# Altium schematic sheet imx8mnano_B.SchDoc
size A3; SheetNumber: 7; SheetTotal: 7
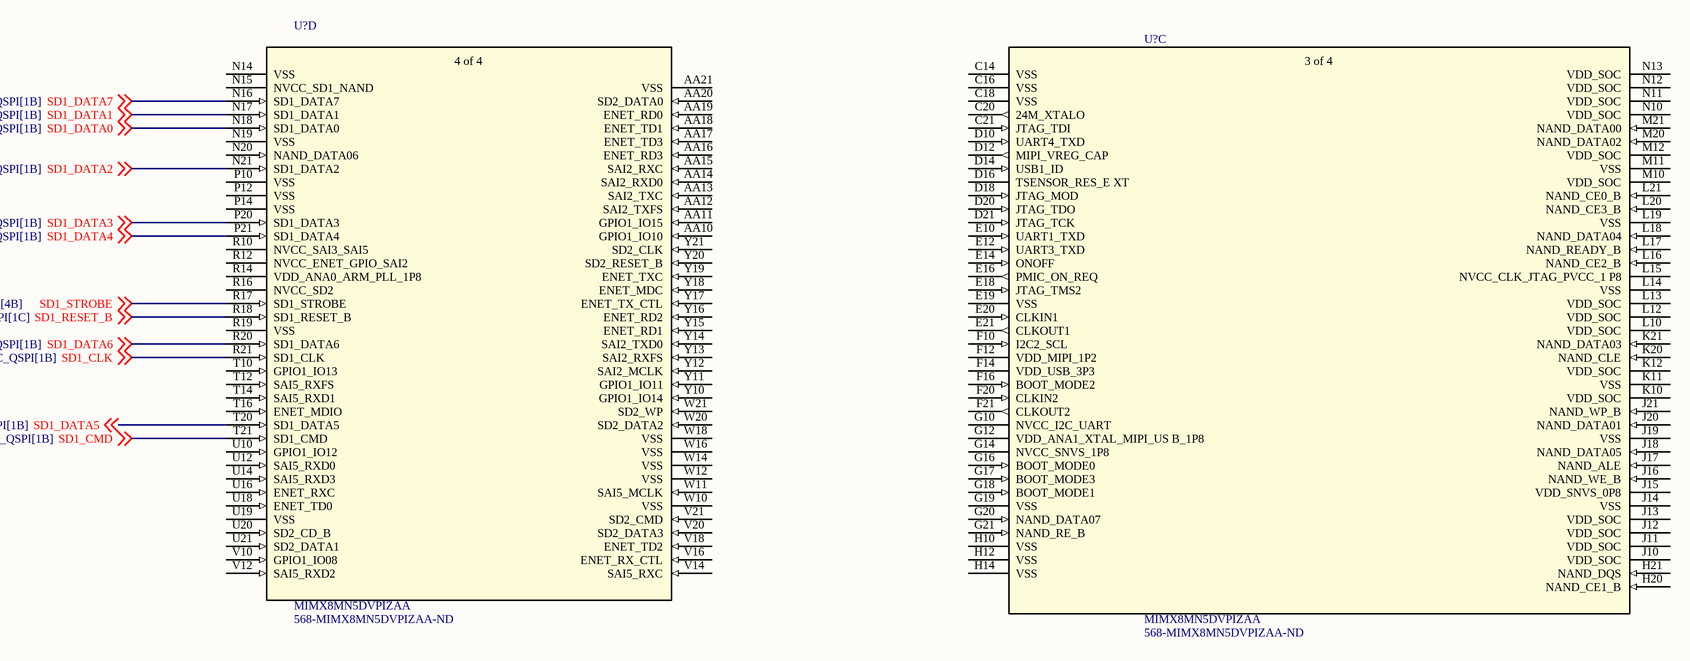
[diagram p0: imx8mnano_B.SchDoc]

## Parts
(Parts that share a designator on the sheet are numbered #1, #2 ... from top to bottom, then left to right.)
U?#1  MIMX8MN5DVPIZAA  Supplier Part Number 1: 568-MIMX8MN5DVPIZAA-ND  [MIMX8MN5DVPIZAA_NXP]  (part D of 4)
U?#2  MIMX8MN5DVPIZAA  Supplier Part Number 1: 568-MIMX8MN5DVPIZAA-ND  [MIMX8MN5DVPIZAA_NXP]  (part C of 4)

## Nets
SD1_CLK: U?#1.R21(SD1_CLK) ; off-sheet SD1_CLK
SD1_CMD: U?#1.T21(SD1_CMD) ; off-sheet SD1_CMD
SD1_DATA0: U?#1.N18(SD1_DATA0) ; off-sheet SD1_DATA0
SD1_DATA1: U?#1.N17(SD1_DATA1) ; off-sheet SD1_DATA1
SD1_DATA2: U?#1.N21(SD1_DATA2) ; off-sheet SD1_DATA2
SD1_DATA3: U?#1.P20(SD1_DATA3) ; off-sheet SD1_DATA3
SD1_DATA4: U?#1.P21(SD1_DATA4) ; off-sheet SD1_DATA4
SD1_DATA5: U?#1.T20(SD1_DATA5) ; off-sheet SD1_DATA5
SD1_DATA6: U?#1.R20(SD1_DATA6) ; off-sheet SD1_DATA6
SD1_DATA7: U?#1.N16(SD1_DATA7) ; off-sheet SD1_DATA7
SD1_RESET_B: U?#1.R18(SD1_RESET_B) ; off-sheet SD1_RESET_B
SD1_STROBE: U?#1.R17(SD1_STROBE) ; off-sheet SD1_STROBE

Not connected (* = marked no-connect by the designer): U?#1 AA10(GPIO1_IO10) AA11(GPIO1_IO15) AA12(SAI2_TXFS) AA13(SAI2_TXC) AA14(SAI2_RXD0) AA15(SAI2_RXC) AA16(ENET_RD3) AA17(ENET_TD3) AA18(ENET_TD1) AA19(ENET_RD0) AA20(SD2_DATA0) AA21(VSS) N14(VSS) N15(NVCC_SD1_NAND) N19(VSS) N20(NAND_DATA06) P10(VSS) P12(VSS) P14(VSS) R10(NVCC_SAI3_SAI5) R12(NVCC_ENET_GPIO_SAI2) R14(VDD_ANA0_ARM_PLL_1P8) R16(NVCC_SD2) R19(VSS) T10(GPIO1_IO13) T12(SAI5_RXFS) T14(SAI5_RXD1) T16(ENET_MDIO) U10(GPIO1_IO12) U12(SAI5_RXD0) U14(SAI5_RXD3) U16(ENET_RXC) U18(ENET_TD0) U19(VSS) U20(SD2_CD_B) U21(SD2_DATA1) V10(GPIO1_IO08) V12(SAI5_RXD2) V14(SAI5_RXC) V16(ENET_RX_CTL) V18(ENET_TD2) V20(SD2_DATA3) V21(SD2_CMD) W10(VSS) W11(SAI5_MCLK) W12(VSS) W14(VSS) W16(VSS) W18(VSS) W20(SD2_DATA2) W21(SD2_WP) Y10(GPIO1_IO14) Y11(GPIO1_IO11) Y12(SAI2_MCLK) Y13(SAI2_RXFS) Y14(SAI2_TXD0) Y15(ENET_RD1) Y16(ENET_RD2) Y17(ENET_TX_CTL) Y18(ENET_MDC) Y19(ENET_TXC) Y20(SD2_RESET_B) Y21(SD2_CLK); U?#2 C14(VSS) C16(VSS) C18(VSS) C20(24M_XTALO) C21(JTAG_TDI) D10(UART4_TXD) D12(MIPI_VREG_CAP) D14(USB1_ID) D16(TSENSOR_RES_E_XT) D18(JTAG_MOD) D20(JTAG_TDO) D21(JTAG_TCK) E10(UART1_TXD) E12(UART3_TXD) E14(ONOFF) E16(PMIC_ON_REQ) E18(JTAG_TMS2) E19(VSS) E20(CLKIN1) E21(CLKOUT1) F10(I2C2_SCL) F12(VDD_MIPI_1P2) F14(VDD_USB_3P3) F16(BOOT_MODE2) F20(CLKIN2) F21(CLKOUT2) G10(NVCC_I2C_UART) G12(VDD_ANA1_XTAL_MIPI_US_B_1P8) G14(NVCC_SNVS_1P8) G16(BOOT_MODE0) G17(BOOT_MODE3) G18(BOOT_MODE1) G19(VSS) G20(NAND_DATA07) G21(NAND_RE_B) H10(VSS) H12(VSS) H14(VSS) H20(NAND_CE1_B) H21(NAND_DQS) J10(VDD_SOC) J11(VDD_SOC) J12(VDD_SOC) J13(VDD_SOC) J14(VSS) J15(VDD_SNVS_0P8) J16(NAND_WE_B) J17(NAND_ALE) J18(NAND_DATA05) J19(VSS) J20(NAND_DATA01) J21(NAND_WP_B) K10(VDD_SOC) K11(VSS) K12(VDD_SOC) K20(NAND_CLE) K21(NAND_DATA03) L10(VDD_SOC) L12(VDD_SOC) L13(VDD_SOC) L14(VSS) L15(NVCC_CLK_JTAG_PVCC_1_P8) L16(NAND_CE2_B) L17(NAND_READY_B) L18(NAND_DATA04) L19(VSS) L20(NAND_CE3_B) L21(NAND_CE0_B) M10(VDD_SOC) M11(VSS) M12(VDD_SOC) M20(NAND_DATA02) M21(NAND_DATA00) N10(VDD_SOC) N11(VDD_SOC) N12(VDD_SOC) N13(VDD_SOC)

## Notes on the sheet
- (in symbol MIMX8MN5DVPIZAA, part C) 3 of 4
- (in symbol MIMX8MN5DVPIZAA, part D) 4 of 4

## Library data of the parts
U?#1 U?#2 = MIMX8MN5DVPIZAA: I.mx 8M Nano Ultralite, Tray Multiple Dp Bakeable, Tray Rohs Compliant: Yes; Manufacturer: NXP Semiconductors; Supplier 1: Digikey; Manufacturer Part Number: MIMX8MN5DVPIZAA; RoHS: Yes; Category: Microprocessors; Stock 1: 138; Pricing 1: 1=24.94, 10=20.041, 25=18.818, 168=17.09119, 336=16.65952, 504=16.44345 (USD)